# Altium project foxbms2-interface-ltc6820.PrjPcb
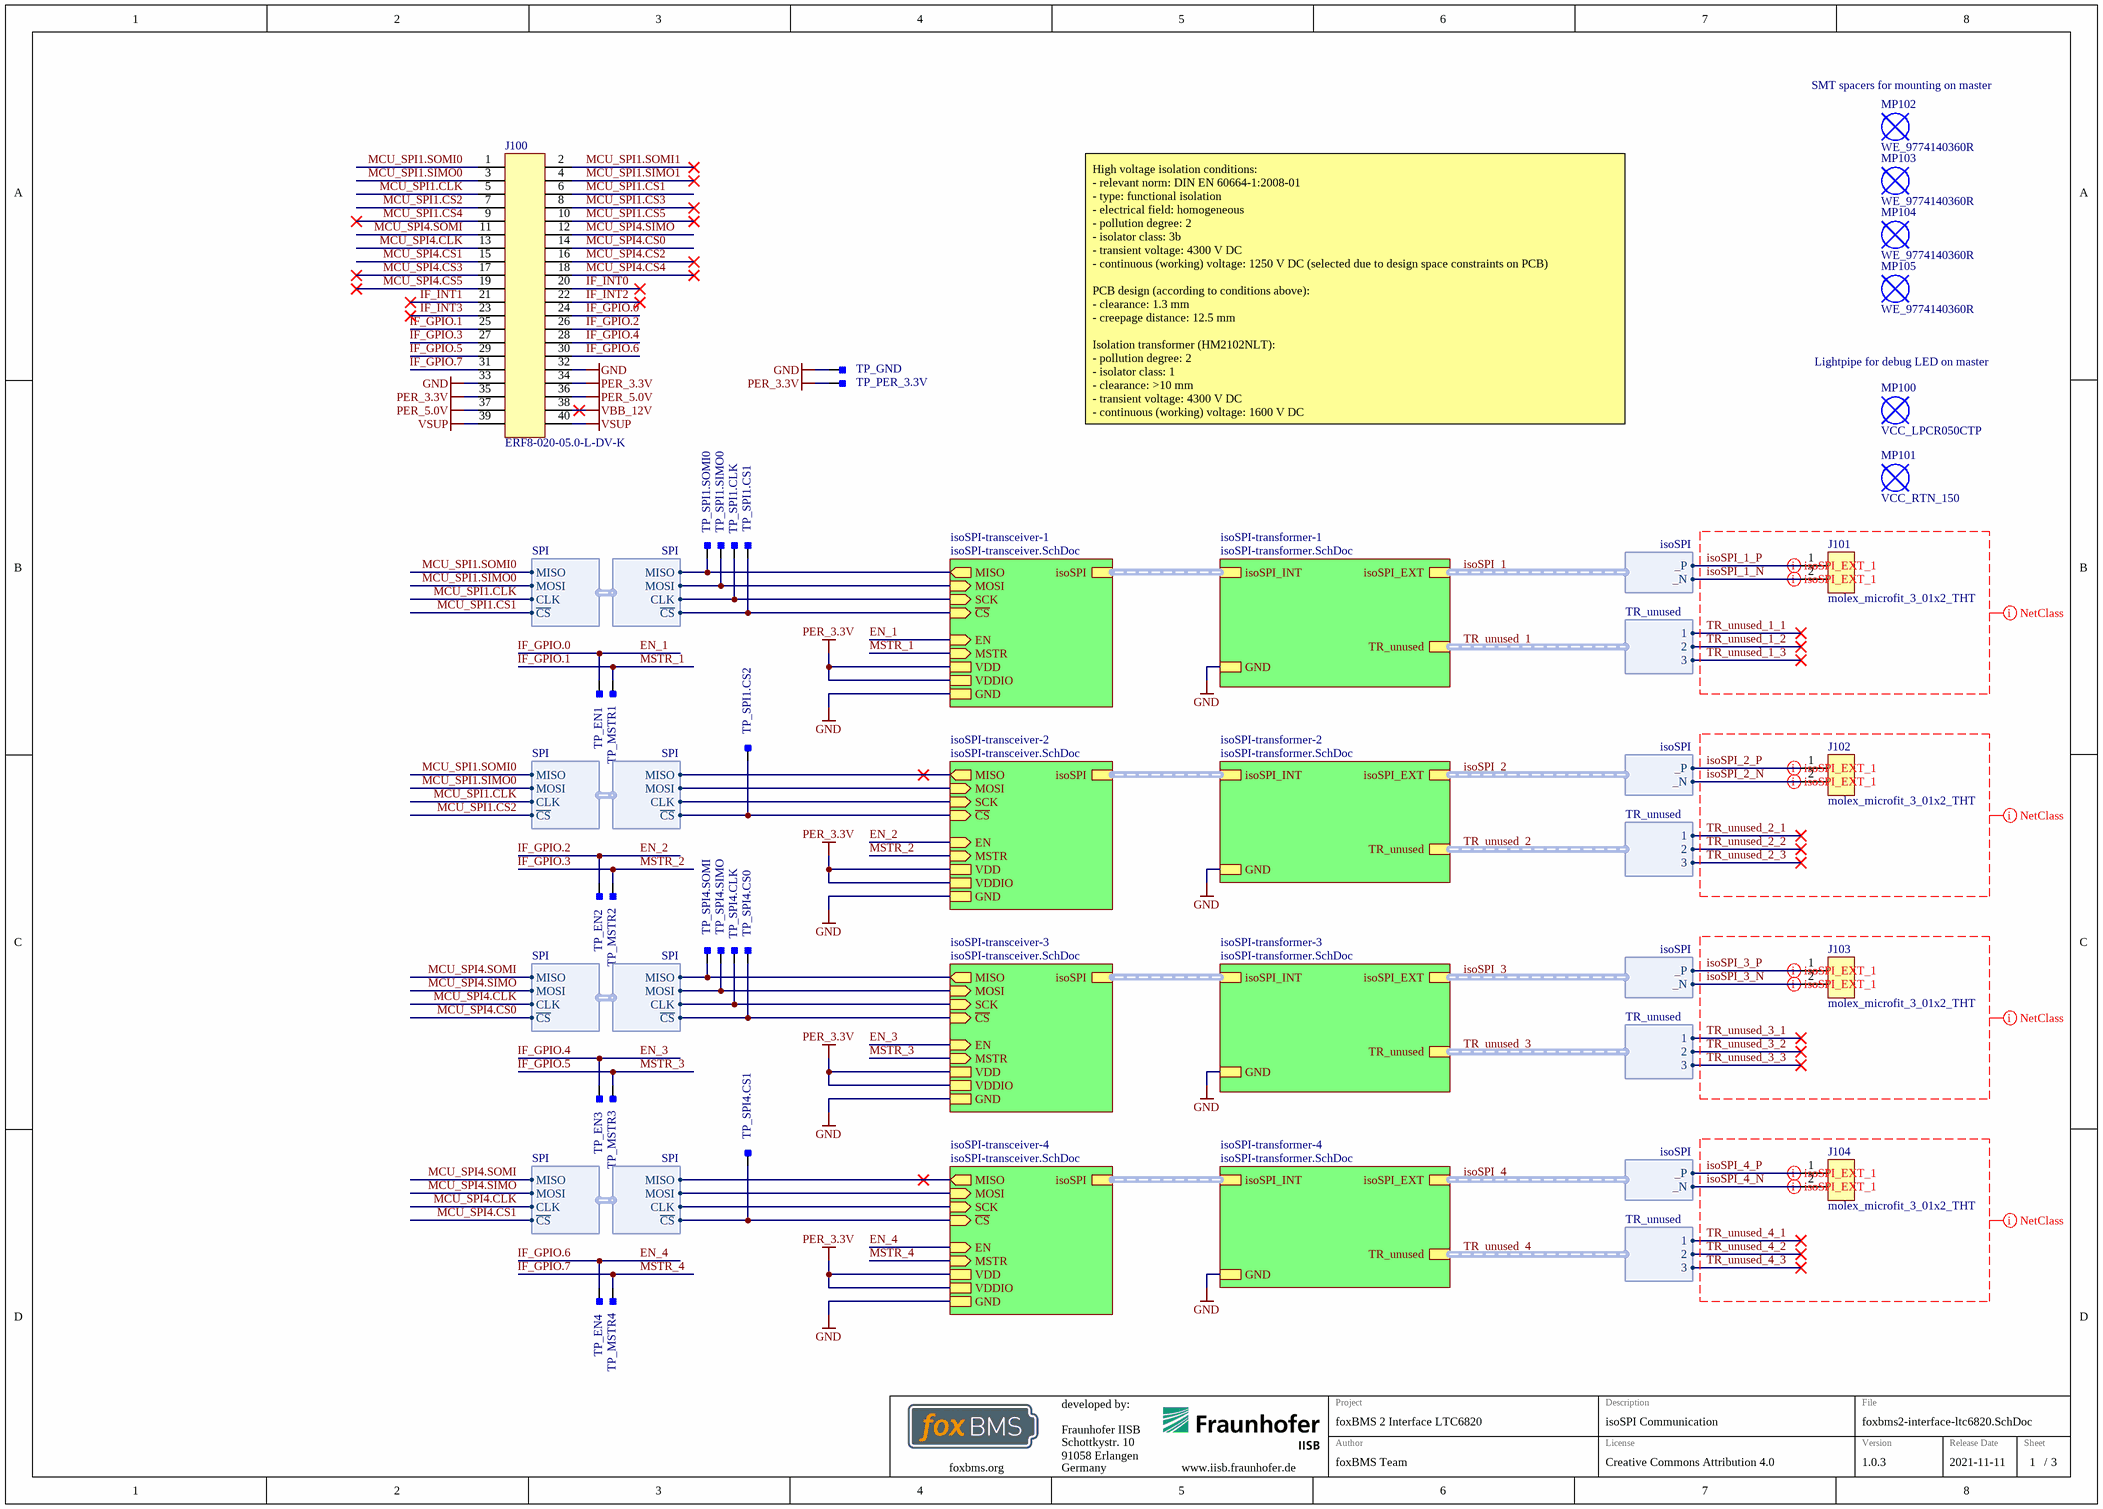
[diagram p0: foxbms2-interface-ltc6820.SchDoc]
GlobalDate: 2021-11-11; GlobalLicense: Creative Commons Attribution 4.0; GlobalProject: foxBMS 2 Interface LTC6820; GlobalVersion: 1.0.3
3 sheets, 95 parts. Net scope: strictly hierarchical (ports join the sheet entries above them; power ports are local).
Board file: foxbms2-interface-ltc6820.PcbDoc
Sheets:
  foxbms2-interface-ltc6820.SchDoc
    isoSPI-transceiver-1 = isoSPI-transceiver.SchDoc
    isoSPI-transformer-1 = isoSPI-transformer.SchDoc
    isoSPI-transceiver-2 = isoSPI-transceiver.SchDoc
    isoSPI-transformer-2 = isoSPI-transformer.SchDoc
    isoSPI-transceiver-3 = isoSPI-transceiver.SchDoc
    isoSPI-transformer-3 = isoSPI-transformer.SchDoc
    isoSPI-transceiver-4 = isoSPI-transceiver.SchDoc
    isoSPI-transformer-4 = isoSPI-transformer.SchDoc

## Sheet foxbms2-interface-ltc6820.SchDoc
size A3; DocumentNumber: 1; SheetNumber: 1; SheetTotal: 3; SheetDescription: isoSPI Communication

### Parts
J100  ERF8-020-05.0-L-DV-K  [SAMTEC_ERF8-020-05.0-L-DV-K]
J101  molex_microfit_3_01x2_THT  [MOLEX_MICROFIT_01x2_THT]
J102  molex_microfit_3_01x2_THT  [MOLEX_MICROFIT_01x2_THT]
J103  molex_microfit_3_01x2_THT  [MOLEX_MICROFIT_01x2_THT]
J104  molex_microfit_3_01x2_THT  [MOLEX_MICROFIT_01x2_THT]
MP100  VCC_LPCR050CTP  [VCC_LPCR050TP]  (mechanical)
MP101  VCC_RTN_150  [VCC_RTN_150]  (mechanical)
MP102  WE_9774140360R  [WE_9774140360]
MP103  WE_9774140360R  [WE_9774140360]
MP104  WE_9774140360R  [WE_9774140360]
MP105  WE_9774140360R  [WE_9774140360]
TP_EN1  Testpoint_Square  [Testpoint_S1]  (value not drawn)  (no BOM)
TP_EN2  Testpoint_Square  [Testpoint_S1]  (value not drawn)  (no BOM)
TP_EN3  Testpoint_Square  [Testpoint_S1]  (value not drawn)  (no BOM)
TP_EN4  Testpoint_Square  [Testpoint_S1]  (value not drawn)  (no BOM)
TP_GND  Testpoint_Square  [Testpoint_S1]  (value not drawn)  (no BOM)
TP_MSTR1  Testpoint_Square  [Testpoint_S1]  (value not drawn)  (no BOM)
TP_MSTR2  Testpoint_Square  [Testpoint_S1]  (value not drawn)  (no BOM)
TP_MSTR3  Testpoint_Square  [Testpoint_S1]  (value not drawn)  (no BOM)
TP_MSTR4  Testpoint_Square  [Testpoint_S1]  (value not drawn)  (no BOM)
TP_PER_3.3V  Testpoint_Square  [Testpoint_S1]  (value not drawn)  (no BOM)
TP_SPI1.CLK  Testpoint_Square  [Testpoint_S1]  (value not drawn)  (no BOM)
TP_SPI1.CS1  Testpoint_Square  [Testpoint_S1]  (value not drawn)  (no BOM)
TP_SPI1.CS2  Testpoint_Square  [Testpoint_S1]  (value not drawn)  (no BOM)
TP_SPI1.SIMO0  Testpoint_Square  [Testpoint_S1]  (value not drawn)  (no BOM)
TP_SPI1.SOMI0  Testpoint_Square  [Testpoint_S1]  (value not drawn)  (no BOM)
TP_SPI4.CLK  Testpoint_Square  [Testpoint_S1]  (value not drawn)  (no BOM)
TP_SPI4.CS0  Testpoint_Square  [Testpoint_S1]  (value not drawn)  (no BOM)
TP_SPI4.CS1  Testpoint_Square  [Testpoint_S1]  (value not drawn)  (no BOM)
TP_SPI4.SIMO  Testpoint_Square  [Testpoint_S1]  (value not drawn)  (no BOM)
TP_SPI4.SOMI  Testpoint_Square  [Testpoint_S1]  (value not drawn)  (no BOM)

### Sub-sheets
isoSPI-transceiver-1 = isoSPI-transceiver.SchDoc: GND, VDDIO, MISO (out), SCK (in), EN (in), ~{CS} (in), VDD, MOSI (in), MSTR (in), isoSPI (harness isoSPI)
isoSPI-transceiver-2 = isoSPI-transceiver.SchDoc: GND, VDDIO, MISO (out), SCK (in), EN (in), ~{CS} (in), VDD, MOSI (in), MSTR (in), isoSPI (harness isoSPI)
isoSPI-transceiver-3 = isoSPI-transceiver.SchDoc: GND, VDDIO, MISO (out), SCK (in), EN (in), ~{CS} (in), VDD, MOSI (in), MSTR (in), isoSPI (harness isoSPI)
isoSPI-transceiver-4 = isoSPI-transceiver.SchDoc: GND, VDDIO, MISO (out), SCK (in), EN (in), ~{CS} (in), VDD, MOSI (in), MSTR (in), isoSPI (harness isoSPI)
isoSPI-transformer-1 = isoSPI-transformer.SchDoc: GND, isoSPI_INT (harness isoSPI), isoSPI_EXT (harness isoSPI), TR_unused (harness TR_unused)
isoSPI-transformer-2 = isoSPI-transformer.SchDoc: GND, isoSPI_INT (harness isoSPI), isoSPI_EXT (harness isoSPI), TR_unused (harness TR_unused)
isoSPI-transformer-3 = isoSPI-transformer.SchDoc: GND, isoSPI_INT (harness isoSPI), isoSPI_EXT (harness isoSPI), TR_unused (harness TR_unused)
isoSPI-transformer-4 = isoSPI-transformer.SchDoc: GND, isoSPI_INT (harness isoSPI), isoSPI_EXT (harness isoSPI), TR_unused (harness TR_unused)

### Harnesses
SPI: CLK, MOSI, MISO, ~{CS}
isoSPI: _P, _N
TR_unused: 1, 2, 3

### Nets
GND: J100.32 J100.33 TP_GND.1 ; sheet isoSPI-transceiver-1/GND, sheet isoSPI-transformer-1/GND, sheet isoSPI-transceiver-2/GND, sheet isoSPI-transformer-2/GND, sheet isoSPI-transceiver-3/GND, sheet isoSPI-transformer-3/GND, sheet isoSPI-transceiver-4/GND, sheet isoSPI-transformer-4/GND
PER_3.3V: J100.34 J100.35 TP_PER_3.3V.1 ; sheet isoSPI-transceiver-1/VDDIO, sheet isoSPI-transceiver-1/VDD, sheet isoSPI-transceiver-2/VDDIO, sheet isoSPI-transceiver-2/VDD, sheet isoSPI-transceiver-3/VDDIO, sheet isoSPI-transceiver-3/VDD, sheet isoSPI-transceiver-4/VDDIO, sheet isoSPI-transceiver-4/VDD
PER_5.0V: J100.36 J100.37
VBB_12V: J100.38
VSUP: J100.39 J100.40
~{IF_INT0}: J100.20
~{IF_INT1}: J100.21
~{IF_INT2}: J100.22
~{IF_INT3}: J100.23
~{MCU_SPI1.CS1}: J100.6 TP_SPI1.CS1.1 ; sheet isoSPI-transceiver-1/~{CS}, harness SPI.~{CS}
~{MCU_SPI1.CS2}: J100.7 TP_SPI1.CS2.1 ; sheet isoSPI-transceiver-2/~{CS}, harness SPI.~{CS}
~{MCU_SPI1.CS3}: J100.8
~{MCU_SPI1.CS4}: J100.9
~{MCU_SPI1.CS5}: J100.10
~{MCU_SPI4.CS0}: J100.14 TP_SPI4.CS0.1 ; sheet isoSPI-transceiver-3/~{CS}, harness SPI.~{CS}
~{MCU_SPI4.CS1}: J100.15 TP_SPI4.CS1.1 ; sheet isoSPI-transceiver-4/~{CS}, harness SPI.~{CS}
~{MCU_SPI4.CS2}: J100.16
~{MCU_SPI4.CS3}: J100.17
~{MCU_SPI4.CS4}: J100.18
~{MCU_SPI4.CS5}: J100.19
EN_1: J100.24 TP_EN1.1 ; sheet isoSPI-transceiver-1/EN  [also labelled IF_GPIO.0]
EN_2: J100.26 TP_EN2.1 ; sheet isoSPI-transceiver-2/EN  [also labelled IF_GPIO.2]
EN_3: J100.28 TP_EN3.1 ; sheet isoSPI-transceiver-3/EN  [also labelled IF_GPIO.4]
EN_4: J100.30 TP_EN4.1 ; sheet isoSPI-transceiver-4/EN  [also labelled IF_GPIO.6]
IF_GPIO.1: J100.25 TP_MSTR1.1 ; sheet isoSPI-transceiver-1/MSTR  [also labelled MSTR_1]
IF_GPIO.3: J100.27 TP_MSTR2.1 ; sheet isoSPI-transceiver-2/MSTR  [also labelled MSTR_2]
IF_GPIO.5: J100.29 TP_MSTR3.1 ; sheet isoSPI-transceiver-3/MSTR  [also labelled MSTR_3]
IF_GPIO.7: J100.31 TP_MSTR4.1 ; sheet isoSPI-transceiver-4/MSTR  [also labelled MSTR_4]
isoSPI_1_N: J101.2 ; sheet isoSPI-transformer-1/isoSPI_EXT._N  [project net isoSPI_1._N]
isoSPI_1_P: J101.1 ; sheet isoSPI-transformer-1/isoSPI_EXT._P  [project net isoSPI_1._P]
isoSPI_2_N: J102.2 ; sheet isoSPI-transformer-2/isoSPI_EXT._N  [project net isoSPI_2._N]
isoSPI_2_P: J102.1 ; sheet isoSPI-transformer-2/isoSPI_EXT._P  [project net isoSPI_2._P]
isoSPI_3_N: J103.2 ; sheet isoSPI-transformer-3/isoSPI_EXT._N  [project net isoSPI_3._N]
isoSPI_3_P: J103.1 ; sheet isoSPI-transformer-3/isoSPI_EXT._P  [project net isoSPI_3._P]
isoSPI_4_N: J104.2 ; sheet isoSPI-transformer-4/isoSPI_EXT._N  [project net isoSPI_4._N]
isoSPI_4_P: J104.1 ; sheet isoSPI-transformer-4/isoSPI_EXT._P  [project net isoSPI_4._P]
MCU_SPI1.CLK: J100.5 TP_SPI1.CLK.1 ; sheet isoSPI-transceiver-1/SCK, sheet isoSPI-transceiver-2/SCK, harness SPI.CLK
MCU_SPI1.SIMO0: J100.3 TP_SPI1.SIMO0.1 ; sheet isoSPI-transceiver-1/MOSI, sheet isoSPI-transceiver-2/MOSI, harness SPI.MOSI
MCU_SPI1.SIMO1: J100.4
MCU_SPI1.SOMI0: J100.1 TP_SPI1.SOMI0.1 ; sheet isoSPI-transceiver-1/MISO, sheet isoSPI-transceiver-2/MISO, harness SPI.MISO
MCU_SPI1.SOMI1: J100.2
MCU_SPI4.CLK: J100.13 TP_SPI4.CLK.1 ; sheet isoSPI-transceiver-3/SCK, sheet isoSPI-transceiver-4/SCK, harness SPI.CLK
MCU_SPI4.SIMO: J100.12 TP_SPI4.SIMO.1 ; sheet isoSPI-transceiver-3/MOSI, sheet isoSPI-transceiver-4/MOSI, harness SPI.MOSI
MCU_SPI4.SOMI: J100.11 TP_SPI4.SOMI.1 ; sheet isoSPI-transceiver-3/MISO, sheet isoSPI-transceiver-4/MISO, harness SPI.MISO

### Buses and harness runs
harness isoSPI_1 = sheet isoSPI-transformer-1/isoSPI_EXT
harness isoSPI_2 = sheet isoSPI-transformer-2/isoSPI_EXT
harness isoSPI_3 = sheet isoSPI-transformer-3/isoSPI_EXT
harness isoSPI_4 = sheet isoSPI-transformer-4/isoSPI_EXT
harness sheet isoSPI-transceiver-1/isoSPI = sheet isoSPI-transformer-1/isoSPI_INT
harness sheet isoSPI-transceiver-2/isoSPI = sheet isoSPI-transformer-2/isoSPI_INT
harness sheet isoSPI-transceiver-3/isoSPI = sheet isoSPI-transformer-3/isoSPI_INT
harness sheet isoSPI-transceiver-4/isoSPI = sheet isoSPI-transformer-4/isoSPI_INT
harness TR_unused_1 = sheet isoSPI-transformer-1/TR_unused
harness TR_unused_2 = sheet isoSPI-transformer-2/TR_unused
harness TR_unused_3 = sheet isoSPI-transformer-3/TR_unused
harness TR_unused_4 = sheet isoSPI-transformer-4/TR_unused

### Layout directives
net class isoSPI_1: isoSPI_1_N, isoSPI_1_P, TR_unused_1_1, TR_unused_1_2, TR_unused_1_3
net class isoSPI_2: isoSPI_2_N, isoSPI_2_P, TR_unused_2_1, TR_unused_2_2, TR_unused_2_3
net class isoSPI_3: isoSPI_3_N, isoSPI_3_P, TR_unused_3_1, TR_unused_3_2, TR_unused_3_3
net class isoSPI_4: isoSPI_4_N, isoSPI_4_P, TR_unused_4_1, TR_unused_4_2, TR_unused_4_3
differential pair: isoSPI_1._N, isoSPI_1._P, isoSPI_2._N, isoSPI_2._P, isoSPI_3._N, isoSPI_3._P, isoSPI_4._N, isoSPI_4._P

### Notes on the sheet
- (near MP102) SMT spacers for mounting on master
- (near MP100) Lightpipe for debug LED on master
- High voltage isolation conditions:
  - relevant norm: DIN EN 60664-1:2008-01
  - type: functional isolation
  - electrical field: homogeneous
  - pollution degree: 2
  - isolator class: 3b
  - transient voltage: 4300 V DC
  - continuous (working) voltage: 1250 V DC (selected due to design space constraints on PCB)
  PCB design (according to conditions above):
  - clearance: 1.3 mm
  - creepage distance: 12.5 mm
  Isolation transformer (HM2102NLT):
  - pollution degree: 2
  - isolator class: 1
  - clearance: >10 mm
  - transient voltage: 4300 V DC
  - continuous (working) voltage: 1600 V DC
- Fraunhofer IISB
- Schottkystr. 10
- developed by:
- 91058 Erlangen
- Germany
- Author
- Project
- License
- Description
- File
- Version
- Release Date
- Sheet
- foxbms.org <https://foxbms.org>
- www.iisb.fraunhofer.de <https://www.iisb.fraunhofer.de/>
- foxBMS Team
- /

### Library data of the parts
J100 = SAMTEC_ERF8-020-05.0-L-DV-K: Edge Rate rugged high-speed connector strips; Manufacturer: Samtec; Circuits: 40; Automotive Qualified: False; Part Number: SAMTEC_ERF8-020-05.0-L-DV-K; Part Name: ERF8-020-05.0-L-DV-K; Operating Temperature: -55°C - +125°C; ComponentLink1Description: Datasheet; ComponentLink1URL: https://suddendocs.samtec.com/catalog_english/erf8-s.pdf; Supplier 1: Farnell; Supplier Part Number 1: 3771957; Supplier 2: Digikey; Supplier Part Number 2: SAM13550CT-ND; Supplier 3: Mouser; Supplier Part Number 3: 200-ERF802005.0LDVLK; ECCN: EAR99; System: Connector
J101-J104 = molex_microfit_3_01x2_THT: Micro-Fit 3.0 Right Angle Header, 3.00mm Pitch, Dual Row, 2 Circuits, with Snap-in Plastic Peg PCB Lock, Tin, Glow Wire Capable, Black, 43045-0200; Manufacturer: Molex; Circuits: 2; Rated Voltage: 600V; Rated Current: 8.5A; Automotive Qualified: False; Part Number: molex_microfit_3_01x2_THT; Part Name: MicroFit; Operating Temperature: -40°C - +105°C; Supplier 1: Farnell; Supplier Part Number 1: 1012251
MP100 = VCC_LPCR050CTP: Lightpipe Clear LPCR Series; Manufacturer: VCC; Automotive Qualified: False; Part Number: VCC_LPCR050CTP; Part Name: VCC_LPCR050CTP; ComponentLink1Description: Datasheet; ComponentLink1URL: https://vcclite.com/wp-content/uploads/wpallimport/files/files/LPCR.pdf; Supplier 1: Digikey; Supplier Part Number 1: LPCR050CTP-ND; Supplier 2: Mouser; Supplier Part Number 2: 593-LPCR050CTP; ECCN: EAR99
MP101 = VCC_RTN_150: Grommet Retainer for LPC and LPCR Series Light Pipe; Manufacturer: VCC; Automotive Qualified: False; Part Number: VCC_RTN_150; Part Name: VCC_RTN_150; ComponentLink1Description: Datasheet; ComponentLink1URL: https://vcclite.com/?file=files/RTN_150.pdf&file_name=RTN_150.pdf; Supplier 1: Digikey; Supplier Part Number 1: RTN_150-ND; Supplier 2: Mouser; Supplier Part Number 2: 593-RTN150; ECCN: EAR99
MP102-MP105 = WE_9774140360R: WA-SMSI SMT Steel Spacer with internal thread M 3; Manufacturer: Würth Elektronik; Automotive Qualified: False; Part Number: WE_9774140360R; Part Name: WE_9774140360R; Operating Temperature: -55°C - +150°C; ComponentLink1Description: Datasheet; ComponentLink1URL: https://www.we-online.com/catalog/datasheet/9774140360R.pdf; Supplier 1: Digikey; Supplier Part Number 1: 732-5281-1-ND; Supplier 2: Mouser; Supplier Part Number 2: 710-9774140360R; ECCN: EAR99
TP_EN1-TP_EN4 TP_GND TP_MSTR1-TP_MSTR4 TP_PER_3.3V TP_SPI1.CLK TP_SPI1.CS1 TP_SPI1.CS2 TP_SPI1.SIMO0 TP_SPI1.SOMI0 TP_SPI4.CLK TP_SPI4.CS0 TP_SPI4.CS1 TP_SPI4.SIMO TP_SPI4.SOMI = Testpoint_Square: Testpoint, square; Automotive Qualified: False; Part Number: Testpoint_Square

## Sheet isoSPI-transceiver.SchDoc
size A3; DocumentNumber: 2; SheetNumber: 2; SheetTotal: 3; SheetDescription: isoSPI Transceiver
Used 4 times, as channels isoSPI-transceiver-1, isoSPI-transceiver-2, isoSPI-transceiver-3, isoSPI-transceiver-4. Parts and nets are listed once, with the designators drawn on the sheet.
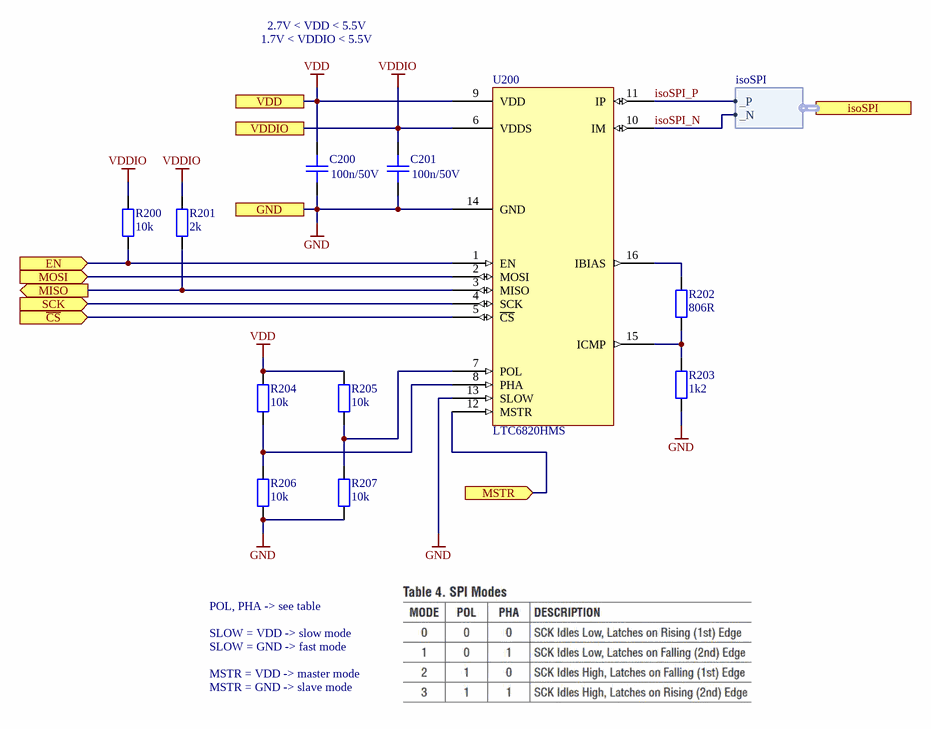
[diagram p1: isoSPI-transceiver.SchDoc]

### Parts
C200  100n/50V  [CAPC1608X08N]
C201  100n/50V  [CAPC1608X08N]
R200  10k  [RESC1608X05N]
R201  2k  [RESC1608X05N]
R202  806R  [RESC1608X05N]
R203  1k2  [RESC1608X05N]
R204  10k  [RESC1608X05N]
R205  10k  [RESC1608X05N]
R206  10k  [RESC1608X05N]
R207  10k  [RESC1608X05N]
U200  LTC6820HMS  [LTC6820-MSOP]

### Ports
EN (in), GND, isoSPI (harness isoSPI), MISO (out), MOSI (in), MSTR (in), SCK (in), VDD, VDDIO, ~{CS} (in)

### Harnesses
isoSPI: _P, _N

### Nets
GND: C200.1 C201.1 R203.1 R206.1 R207.1 U200.13(SLOW) U200.14(GND) ; port GND
VDD: C200.2 R204.2 R205.2 U200.9(VDD) ; port VDD
VDDIO: C201.2 R200.2 R201.2 U200.6(VDDS) ; port VDDIO
~{CS}: U200.5(~{CS}) ; port ~{CS}
EN: R200.1 U200.1(EN) ; port EN
isoSPI_N: U200.10(IM) ; port isoSPI._N
isoSPI_P: U200.11(IP) ; port isoSPI._P
MISO: R201.1 U200.3(MISO) ; port MISO
MOSI: U200.2(MOSI) ; port MOSI
MSTR: U200.12(MSTR) ; port MSTR
SCK: U200.4(SCK) ; port SCK
NetR202_1: R202.1 R203.2 U200.15(ICMP)
NetR202_2: R202.2 U200.16(IBIAS)
NetR204_1: R204.1 R206.2 U200.8(PHA)
NetR205_1: R205.1 R207.2 U200.7(POL)

### Channels
isoSPI-transceiver-1: designators end in _1; ports EN=EN_1 GND=GND MISO=MCU_SPI1.SOMI0 MOSI=MCU_SPI1.SIMO0 MSTR=IF_GPIO.1 SCK=MCU_SPI1.CLK VDD=PER_3.3V VDDIO=PER_3.3V ~{CS}=~{MCU_SPI1.CS1}
isoSPI-transceiver-2: designators end in _2; ports EN=EN_2 GND=GND MISO=MCU_SPI1.SOMI0 MOSI=MCU_SPI1.SIMO0 MSTR=IF_GPIO.3 SCK=MCU_SPI1.CLK VDD=PER_3.3V VDDIO=PER_3.3V ~{CS}=~{MCU_SPI1.CS2}
isoSPI-transceiver-3: designators end in _3; ports EN=EN_3 GND=GND MISO=MCU_SPI4.SOMI MOSI=MCU_SPI4.SIMO MSTR=IF_GPIO.5 SCK=MCU_SPI4.CLK VDD=PER_3.3V VDDIO=PER_3.3V ~{CS}=~{MCU_SPI4.CS0}
isoSPI-transceiver-4: designators end in _4; ports EN=EN_4 GND=GND MISO=MCU_SPI4.SOMI MOSI=MCU_SPI4.SIMO MSTR=IF_GPIO.7 SCK=MCU_SPI4.CLK VDD=PER_3.3V VDDIO=PER_3.3V ~{CS}=~{MCU_SPI4.CS1}

### Notes on the sheet
- 2.7V < VDD < 5.5V
- 1.7V < VDDIO < 5.5V
- POL, PHA -> see table
- SLOW = VDD -> slow mode
- SLOW = GND -> fast mode
- MSTR = VDD -> master mode
- MSTR = GND -> slave mode
- Fraunhofer IISB
- Schottkystr. 10
- developed by:
- 91058 Erlangen
- Germany
- Author
- Project
- License
- Description
- File
- Version
- Release Date
- Sheet
- foxbms.org <https://foxbms.org>
- www.iisb.fraunhofer.de <https://www.iisb.fraunhofer.de/>
- foxBMS Team
- /

### Library data of the parts
C200 C201 = gen_C_ceramic_100n_50V_X7R_0603: MLCC; Capacitance: 100n; Rated Voltage: 50V; Dielectric: X7R; Case EIA: 0603; Case Metric: 1608; PnP Package: 0603C; PnP Value: 100nF/50V/X7R; PnP equipped: x; Automotive Qualified: True; AEC-Q Norm: AEC-Q200; Part Number: gen_C_ceramic_100n_50V_X7R_0603; Supplier 1: Farnell; Supplier Part Number 1: 2525267; ECCN: EAR99; Supplier 2: Digikey; Supplier Part Number 2: 490-6049-1-ND
R200 R204-R207 = gen_R_10k_0603: SMD Resistor 10k 0603; Tolerance: 1%; Power: 0.1W; Case EIA: 0603; Case Metric: 1608; Maximum Working Voltage: 75V; PnP Package: 0603R; Automotive Qualified: True; PnP equipped: x; Part Number: gen_R_10k_0603; Operating Temperature: -55°C - +155°C; Resistance: 10k; Series: E24, E96; PnP Value: 10k; Supplier 1: Farnell; Supplier Part Number 1: 2073349
R201 = gen_R_2k_0603: SMD Resistor 2k 0603; Tolerance: 1%; Power: 0.1W; Case EIA: 0603; Case Metric: 1608; Maximum Working Voltage: 75V; PnP Package: 0603R; Automotive Qualified: True; Part Number: gen_R_2k_0603; Operating Temperature: -55°C - +155°C; Resistance: 2k; Series: E24, E96; PnP Value: 2k; Supplier 1: Farnell; Supplier Part Number 1: 2059343
R202 = gen_R_806R_0603: SMD Resistor 806R 0603; Tolerance: 1%; Power: 0.1W; Case EIA: 0603; Case Metric: 1608; Maximum Working Voltage: 75V; PnP Package: 0603R; Automotive Qualified: True; Part Number: gen_R_806R_0603; Operating Temperature: -55°C - +155°C; Resistance: 806R; Series: E96; PnP Value: 806R; Supplier 1: Farnell; Supplier Part Number 1: 2059324
R203 = gen_R_1k2_0603: SMD Resistor 1k2 0603; Tolerance: 1%; Power: 0.1W; Case EIA: 0603; Case Metric: 1608; Maximum Working Voltage: 75V; PnP Package: 0603R; Automotive Qualified: True; Part Number: gen_R_1k2_0603; Operating Temperature: -55°C - +155°C; Resistance: 1k2; Series: E24; PnP Value: 1k2; Supplier 1: Farnell; Supplier Part Number 1: 2073370
U200 = LTC6820HMS: isoSPI Isolated Communications Interface; Manufacturer: Analog Devices; PnP Package: MSOP-16; Automotive Qualified: True; Part Number: LTC6820HMS; Part Name: LTC6820HMS; Operating Temperature: −40°C - +125°C; ComponentLink1Description: Datasheet; ComponentLink1URL: https://www.analog.com/media/en/technical-documentation/data-sheets/LTC6820.pdf; Supplier 1: Mouser; Supplier Part Number 1: 584-LTC6820HMS#PBF; Supplier 2: Digikey; Supplier Part Number 2: LTC6820HMS#TRPBFCT-ND

## Sheet isoSPI-transformer.SchDoc
size A3; DocumentNumber: 3; SheetNumber: 3; SheetTotal: 3; SheetDescription: isoSPI Transformer
Used 4 times, as channels isoSPI-transformer-1, isoSPI-transformer-2, isoSPI-transformer-3, isoSPI-transformer-4. Parts and nets are listed once, with the designators drawn on the sheet.
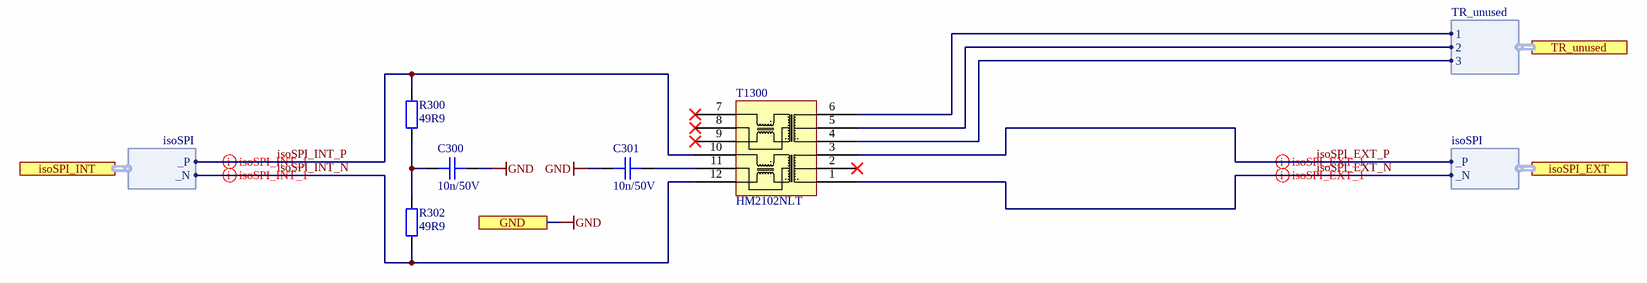
[diagram p2: isoSPI-transformer.SchDoc]

### Parts
C300  10n/50V  [CAPC1608X08N]
C301  10n/50V  [CAPC1608X08N]
R300  49R9  [RESC1608X05N]
R302  49R9  [RESC1608X05N]
T1300  HM2102NLT  [HM2102NL]

### Ports
GND, isoSPI_EXT (harness isoSPI), isoSPI_INT (harness isoSPI), TR_unused (harness TR_unused)

### Harnesses
isoSPI: _P, _N
TR_unused: 1, 2, 3

### Nets
GND: C300.2 C301.1 ; port GND
isoSPI_EXT_N: T1300.1 ; port isoSPI_EXT._N
isoSPI_EXT_P: T1300.3 ; port isoSPI_EXT._P
isoSPI_INT_N: R302.1 T1300.12 ; port isoSPI_INT._N
isoSPI_INT_P: R300.2 T1300.10 ; port isoSPI_INT._P
NetC300_1: C300.1 R300.1 R302.2
NetC301_2: C301.2 T1300.11
NetT1300_4: T1300.4 ; port TR_unused.3
NetT1300_5: T1300.5 ; port TR_unused.2
NetT1300_6: T1300.6 ; port TR_unused.1

Not connected (* = marked no-connect by the designer): T1300 2* 7* 8* 9*

### Channels
isoSPI-transformer-1: designators end in _1; ports GND=GND
isoSPI-transformer-2: designators end in _2; ports GND=GND
isoSPI-transformer-3: designators end in _3; ports GND=GND
isoSPI-transformer-4: designators end in _4; ports GND=GND

### Layout directives
differential pair: isoSPI_1._N, isoSPI_1._P, isoSPI_INT_N, isoSPI_INT_P

### Notes on the sheet
- Fraunhofer IISB
- Schottkystr. 10
- developed by:
- 91058 Erlangen
- Germany
- Author
- Project
- License
- Description
- File
- Version
- Release Date
- Sheet
- foxbms.org <https://foxbms.org>
- www.iisb.fraunhofer.de <https://www.iisb.fraunhofer.de/>
- foxBMS Team
- /

### Library data of the parts
C300 C301 = gen_C_ceramic_10n_50V_C0G_0603: MLCC; Capacitance: 10n; Rated Voltage: 50V; Dielectric: C0G; Case EIA: 0603; Case Metric: 1608; Automotive Qualified: True; PnP Package: 0603C; Part Number: gen_C_ceramic_10n_50V_C0G_0603; Supplier 1: Farnell; Supplier Part Number 1: 2210846
R300 R302 = gen_R_49R9_0603: SMD Resistor 49R9 0603; Tolerance: 1%; Power: 0.1W; Case EIA: 0603; Case Metric: 1608; Maximum Working Voltage: 75V; PnP Package: 0603R; Automotive Qualified: True; Part Number: gen_R_49R9_0603; Operating Temperature: -55°C - +155°C; Resistance: 49R9; Series: E96; PnP Value: 49R9; Supplier 1: Digikey; Supplier Part Number 1: P49.9HCT-ND
T1300 = HM2102NLT: Pulse HM2102NLT BMS Transformer; Automotive Qualified: True; AEC-Q Norm: AEC-Q200; Part Number: HM2102NLT; Manufacturer: Pulse; Operating Temperature: -40°C - +125°C; ComponentLink1Description: Datasheet; ComponentLink1URL: https://www.mouser.de/datasheet/2/336/HM2102NL-1218600.pdf; Supplier 1: Mouser; Supplier Part Number 1: 673-HM2102NLT; Supplier 2: Digikey; Supplier Part Number 2: 1840-1034-1-ND; ECCN: EAR99

## Nets that join several sheets
GND: foxbms2-interface-ltc6820 (J100.32 J100.33 TP_GND.1), isoSPI-transceiver-1 (7 pins), isoSPI-transformer-1 (C300_1.2 C301_1.1), isoSPI-transceiver-2 (7 pins), isoSPI-transformer-2 (C300_2.2 C301_2.1), isoSPI-transceiver-3 (7 pins), isoSPI-transformer-3 (C300_3.2 C301_3.1), isoSPI-transceiver-4 (7 pins), isoSPI-transformer-4 (C300_4.2 C301_4.1)
PER_3.3V: foxbms2-interface-ltc6820 (J100.34 J100.35 TP_PER_3.3V.1), isoSPI-transceiver-1 (8 pins), isoSPI-transceiver-2 (8 pins), isoSPI-transceiver-3 (8 pins), isoSPI-transceiver-4 (8 pins)
~{MCU_SPI1.CS1}: foxbms2-interface-ltc6820 (J100.6 TP_SPI1.CS1.1), isoSPI-transceiver-1 (U200_1.5)
~{MCU_SPI1.CS2}: foxbms2-interface-ltc6820 (J100.7 TP_SPI1.CS2.1), isoSPI-transceiver-2 (U200_2.5)
~{MCU_SPI4.CS0}: foxbms2-interface-ltc6820 (J100.14 TP_SPI4.CS0.1), isoSPI-transceiver-3 (U200_3.5)
~{MCU_SPI4.CS1}: foxbms2-interface-ltc6820 (J100.15 TP_SPI4.CS1.1), isoSPI-transceiver-4 (U200_4.5)
EN_1: foxbms2-interface-ltc6820 (J100.24 TP_EN1.1), isoSPI-transceiver-1 (R200_1.1 U200_1.1)
EN_2: foxbms2-interface-ltc6820 (J100.26 TP_EN2.1), isoSPI-transceiver-2 (R200_2.1 U200_2.1)
EN_3: foxbms2-interface-ltc6820 (J100.28 TP_EN3.1), isoSPI-transceiver-3 (R200_3.1 U200_3.1)
EN_4: foxbms2-interface-ltc6820 (J100.30 TP_EN4.1), isoSPI-transceiver-4 (R200_4.1 U200_4.1)
IF_GPIO.1: foxbms2-interface-ltc6820 (J100.25 TP_MSTR1.1), isoSPI-transceiver-1 (U200_1.12)
IF_GPIO.3: foxbms2-interface-ltc6820 (J100.27 TP_MSTR2.1), isoSPI-transceiver-2 (U200_2.12)
IF_GPIO.5: foxbms2-interface-ltc6820 (J100.29 TP_MSTR3.1), isoSPI-transceiver-3 (U200_3.12)
IF_GPIO.7: foxbms2-interface-ltc6820 (J100.31 TP_MSTR4.1), isoSPI-transceiver-4 (U200_4.12)
isoSPI_1._N: foxbms2-interface-ltc6820 (J101.2), isoSPI-transformer-1 (T1300_1.1)
isoSPI_1._P: foxbms2-interface-ltc6820 (J101.1), isoSPI-transformer-1 (T1300_1.3)
isoSPI_2._N: foxbms2-interface-ltc6820 (J102.2), isoSPI-transformer-2 (T1300_2.1)
isoSPI_2._P: foxbms2-interface-ltc6820 (J102.1), isoSPI-transformer-2 (T1300_2.3)
isoSPI_3._N: foxbms2-interface-ltc6820 (J103.2), isoSPI-transformer-3 (T1300_3.1)
isoSPI_3._P: foxbms2-interface-ltc6820 (J103.1), isoSPI-transformer-3 (T1300_3.3)
isoSPI_4._N: foxbms2-interface-ltc6820 (J104.2), isoSPI-transformer-4 (T1300_4.1)
isoSPI_4._P: foxbms2-interface-ltc6820 (J104.1), isoSPI-transformer-4 (T1300_4.3)
isoSPI_INT_N: isoSPI-transceiver-1 (U200_1.10), isoSPI-transformer-1 (R302_1.1 T1300_1.12)
isoSPI_INT_N: isoSPI-transceiver-2 (U200_2.10), isoSPI-transformer-2 (R302_2.1 T1300_2.12)
isoSPI_INT_N: isoSPI-transceiver-3 (U200_3.10), isoSPI-transformer-3 (R302_3.1 T1300_3.12)
isoSPI_INT_N: isoSPI-transceiver-4 (U200_4.10), isoSPI-transformer-4 (R302_4.1 T1300_4.12)
isoSPI_INT_P: isoSPI-transceiver-1 (U200_1.11), isoSPI-transformer-1 (R300_1.2 T1300_1.10)
isoSPI_INT_P: isoSPI-transceiver-2 (U200_2.11), isoSPI-transformer-2 (R300_2.2 T1300_2.10)
isoSPI_INT_P: isoSPI-transceiver-3 (U200_3.11), isoSPI-transformer-3 (R300_3.2 T1300_3.10)
isoSPI_INT_P: isoSPI-transceiver-4 (U200_4.11), isoSPI-transformer-4 (R300_4.2 T1300_4.10)
MCU_SPI1.CLK: foxbms2-interface-ltc6820 (J100.5 TP_SPI1.CLK.1), isoSPI-transceiver-1 (U200_1.4), isoSPI-transceiver-2 (U200_2.4)
MCU_SPI1.SIMO0: foxbms2-interface-ltc6820 (J100.3 TP_SPI1.SIMO0.1), isoSPI-transceiver-1 (U200_1.2), isoSPI-transceiver-2 (U200_2.2)
MCU_SPI1.SOMI0: foxbms2-interface-ltc6820 (J100.1 TP_SPI1.SOMI0.1), isoSPI-transceiver-1 (R201_1.1 U200_1.3), isoSPI-transceiver-2 (R201_2.1 U200_2.3)
MCU_SPI4.CLK: foxbms2-interface-ltc6820 (J100.13 TP_SPI4.CLK.1), isoSPI-transceiver-3 (U200_3.4), isoSPI-transceiver-4 (U200_4.4)
MCU_SPI4.SIMO: foxbms2-interface-ltc6820 (J100.12 TP_SPI4.SIMO.1), isoSPI-transceiver-3 (U200_3.2), isoSPI-transceiver-4 (U200_4.2)
MCU_SPI4.SOMI: foxbms2-interface-ltc6820 (J100.11 TP_SPI4.SOMI.1), isoSPI-transceiver-3 (R201_3.1 U200_3.3), isoSPI-transceiver-4 (R201_4.1 U200_4.3)

## Assembly variants
default: not fitted R200_2 R200_4 R201_2 R201_4 R204_1 R204_2 R204_3 R204_4 R205_1 R205_2 R205_3 R205_4